# Altium schematic sheet Tape.SchDoc
size A4
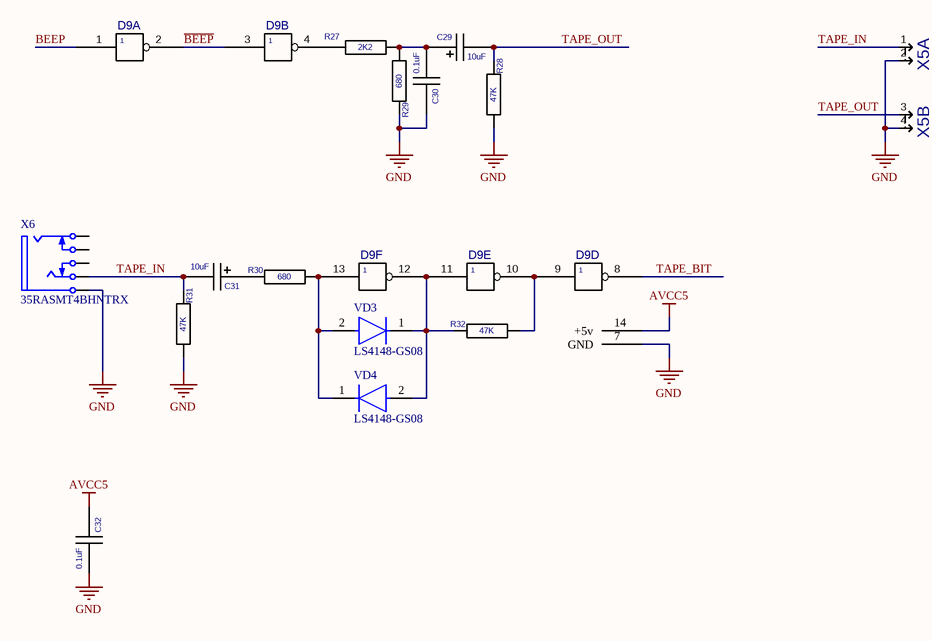
[diagram p0: Tape.SchDoc]

## Parts
C29  value 10uF  [EC-CHIP]  (hidden comment: ECAPCHIP)
C30  value 0.1uF  [C-CHIP]  (hidden comment: CAPCHIP)
C31  value 10uF  [EC-CHIP]  (hidden comment: ECAPCHIP)
C32  value 0.1uF  [C-CHIP]  (hidden comment: CAPCHIP)
D9  CD4069M  [SO14]  (value not drawn)  (parts A,B,D,E,F of 6)
R27  value 2K2  [R-CHIP]  (hidden comment: RESCHIP)
R28  value 47K  [R-CHIP]  (hidden comment: RESCHIP)
R29  value 680  [R-CHIP]  (hidden comment: RESCHIP)
R30  value 680  [R-CHIP]  (hidden comment: RESCHIP)
R31  value 47K  [R-CHIP]  (hidden comment: RESCHIP)
R32  value 47K  [R-CHIP]  (hidden comment: RESCHIP)
VD3  LS4148-GS08  [FP-6_560-5006_01-4-MFG]
VD4  LS4148-GS08  [FP-6_560-5006_01-4-MFG]
X5  PLB2-2  [PLB2-2]  (value not drawn)  (parts A,B of 2)
X6  35RASMT4BHNTRX  [SWIT-35RASMT4BHNTRX_V]

## Nets
AGND: D9.7(GND)
AVCC5: C32.1 D9.14(+5v)
GND: C30.1 C32.2 D9.7(GND) R28.1(i/o) R29.2(i/o1) R31.1(i/o) X5.2 X5.4 X6.1
~{BEEP}: D9.2 D9.3
BEEP: D9.1
TAPE_BIT: D9.8
TAPE_IN: C31.2 R31.2(i/o1) X5.1 X6.3
TAPE_OUT: C29.2 R28.2(i/o1) X5.3
NetC29_1: C29.1 C30.2 R27.1(i/o) R29.1(i/o)
NetC31_1: C31.1 R30.2(i/o1)
NetD9_4: D9.4 R27.2(i/o1)
NetD9_9: D9.9 D9.10 R32.1(i/o)
NetD9_11: D9.11 D9.12 R32.2(i/o1) VD3.1(C) VD4.2(A)
NetD9_13: D9.13 R30.1(i/o) VD3.2(A) VD4.1(C)

Not connected (* = marked no-connect by the designer): X6 2 4 5

## Library data of the parts
VD3 VD4 = CMP-02540-000025-1: DIODE GEN PURP 75V 150MA SOD80; Manufacturer: Vishay Semiconductor Diodes Division; Max Junction Temp: +175°C; Capacitance: 4pF; Value: 4pF; Forward Current: 300mA; Peak Reverse Current: 5uA; Max Repetitive Reverse Voltage: 100V; Automotive Grade: Grade 0; Max Surge Forward Current: 2A; RoHS: TRUE; Mouser Description: LS4148 Series 100 V 150 mA Small Signal Fast Switching Diode - QuadroMELF SOD-80; Octopart: https://octopart.com/ls4148-gs08-vishay-55401771; Height: 1.6mm; Reverse Voltage: 75V; Temperature Range High: +175°C; Device Class L2: Diodes; Category: Diode; Temperature: to +175°C; Device Class L3: Rectifier Diodes; Automotive: Yes; Device Class L1: Discrete Semiconductors; ComponentLink2URL: http://www.vishay.com/docs/85561/ls4148.pdf; Manufacturer Part Number: LS4148-GS08; Package: 6.560-5006.01-4; Lead Free: Yes; ComponentLink2Description: Datasheet; Digikey Description: DIODE GEN PURP 75V 150MA SOD80
X6 = CMP-1772-00001-1: Female 3.5 mm Phone Jack, 5 Position, Height 5 mm, RoHS, Tape and Reel; Current Rating: 50 mA; Voltage Rating (DC): 12 V; ComponentLink1URL: http://www.switchcraft.com/; ComponentLink2Description: Datasheet; ComponentLink2URL: http://www.switchcraft.com/Drawings/35rasmt4bhntrx_cd.pdf; PackageDescription: Female 3.5 mm Phone Jack, 5 Position, Height 5 mm; PackageReference: 35RASMT4BHNTRX; Mount: Through Hole; DatasheetVersion: Rev. C, 07/2014; Contact Material: Silver; ComponentLink1Description: Manufacturer URL; Packaging: Tape and Reel; RoHSCompliant: true; Contact Plating: Silver; Package Quantity: 3000
X5 = PLB2-2: Value: *